# EasyEDA schematic SCH_Smart led driver_2022-09-08.json
TITLE: Sheet_1; REV: 1.0; Date: 2021-10-26; Sheet: 1/1; Drawn By: Max Solo; Company: Your Company
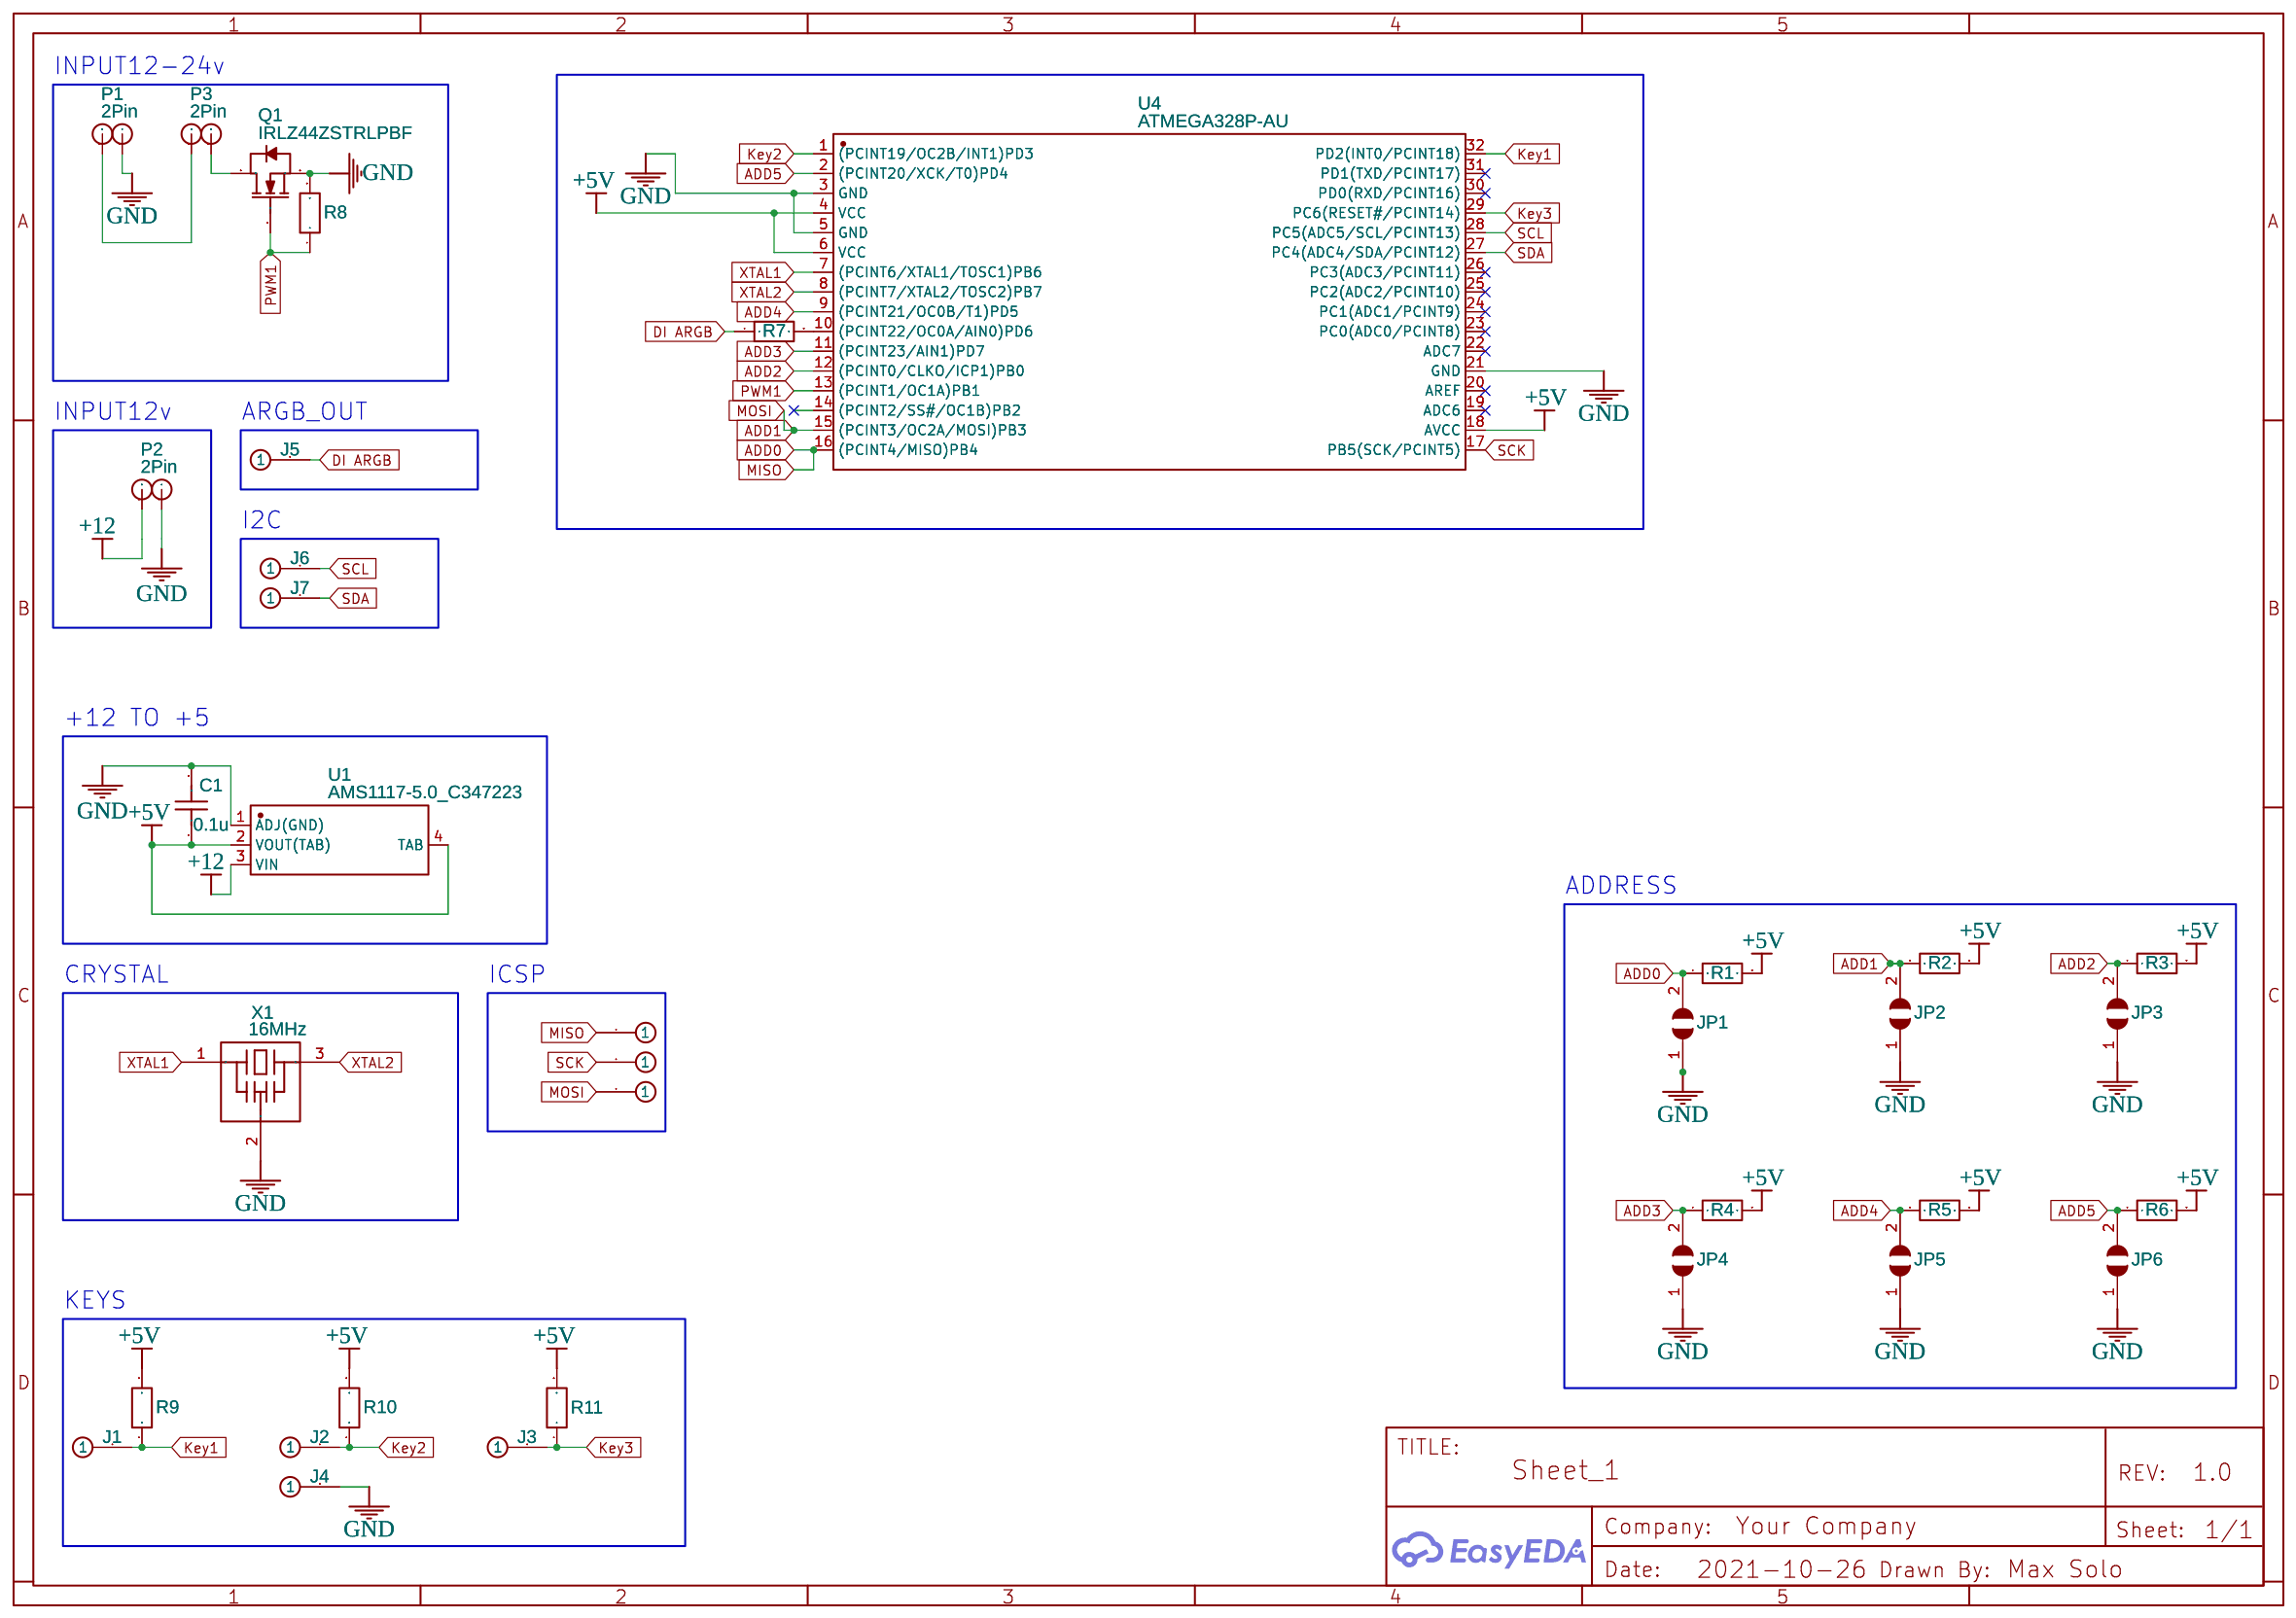
[diagram p0: schematic sheet]

## Parts
C1  0.1u  [C0603]
J1  1PIN_SMD  [1PIN_SMD]
J2  1PIN_SMD  [1PIN_SMD]
J3  1PIN_SMD  [1PIN_SMD]
J4  1PIN_SMD  [1PIN_SMD]
J5  1PIN_SMD  [1PIN_SMD]
J6  1PIN_SMD  [1PIN_SMD]
J7  1PIN_SMD  [1PIN_SMD]
J8  1PIN_SMD  [1PIN_SMD]
J9  1PIN_SMD  [1PIN_SMD]
J12  1PIN_SMD  [1PIN_SMD]
JP1  MINI-ULTRA-LORAWAN-rescue_JUMPER-1-WAY-RocketScreamKicadLibrary  [JUMPER-1-WAY-SMD]
JP2  MINI-ULTRA-LORAWAN-rescue_JUMPER-1-WAY-RocketScreamKicadLibrary  [JUMPER-1-WAY-SMD]
JP3  MINI-ULTRA-LORAWAN-rescue_JUMPER-1-WAY-RocketScreamKicadLibrary  [JUMPER-1-WAY-SMD]
JP4  MINI-ULTRA-LORAWAN-rescue_JUMPER-1-WAY-RocketScreamKicadLibrary  [JUMPER-1-WAY-SMD]
JP5  MINI-ULTRA-LORAWAN-rescue_JUMPER-1-WAY-RocketScreamKicadLibrary  [JUMPER-1-WAY-SMD]
JP6  MINI-ULTRA-LORAWAN-rescue_JUMPER-1-WAY-RocketScreamKicadLibrary  [JUMPER-1-WAY-SMD]
P1  2Pin  [2PIN]
P2  2Pin  [2PIN]
P3  2Pin  [2PIN]
Q1  IRLZ44ZSTRLPBF  [D2PAK_L10.0-W9.0-P2.54-LS15.0-BR]
R1  10k  [R0603]
R2  10k  [R0603]
R3  10k  [R0603]
R4  10k  [R0603]
R5  10k  [R0603]
R6  10k  [R0603]
R7  300  [R0603]
R8  10k  [R0603]
R9  1k  [R0603]
R10  1k  [R0603]
R11  1k  [R0603]
U1  AMS1117-5.0_C347223  [SOT-223_L6.7-W3.5-P2.30-BR]
U4  ATMEGA328P-AU  [TQFP-32_L7.0-W7.0-P0.80-LS9.0-BL]
X1  16MHz  [OSC-SMD_3P-L3.2-W1.3-P1.2-L]

## Library data of the parts
C1 = C_0603_US: Contributor: LCEDA_Lib
J1-J9 J12 = 1PIN_SMD: Contributor: JoshuaFireseed
JP1-JP6 = MINI-ULTRA-LORAWAN-rescue_JUMPER-1-WAY-RocketScreamKicadLibrary: Contributor: MOS-FET
P1-P3 = 2Pin: Contributor: danijel1023
Q1 = IRLZ44ZSTRLPBF: Supplier: LCSC; Supplier Part: C538201; Manufacturer: Infineon Technologies; Contributor: LCSC; JLCPCB Part Class: Extended Part
R1-R11 = R_0603_EU: Contributor: LCEDA_Lib
U1 = AMS1117-5.0_C347223: Supplier: LCSC; Supplier Part: C347223; Manufacturer: Youtai Semiconductor Co., Ltd.; Manufacturer Part: AMS1117-5.0; Contributor: LCSC; JLCPCB Part Class: Extended Part
U4 = ATMEGA328P-AU: Supplier: LCSC; Manufacturer: MICROCHIP; Supplier Part: C14877; JLCPCB Part Class: Basic Part
X1 = CSTCE16M0V13C99-R0: Supplier: LCSC; Manufacturer: MuRata; Supplier Part: C118038; JLCPCB Part Class: Extended Part

## Nets
+5V: C1.1 R1.2 R2.2 R3.2 R4.2 R5.2 R6.2 R9.2 R10.2 R11.2 U1.2(VOUT(TAB)) U1.4(TAB) U4.4(VCC) U4.6(VCC) U4.18(AVCC)
GND: C1.2 J4.1 JP1.1 JP2.1 JP3.1 JP4.1 JP5.1 JP6.1 P1.1 P2.1 Q1.3(S) R8.2 U1.1(ADJ(GND)) U4.3(GND) U4.5(GND) U4.21(GND) X1.2(VSS)
+12: P2.2 U1.3(VIN)
ADD0: J8.1 JP1.2 R1.1 U4.16((PCINT4/MISO)PB4)
ADD1: J12.1 JP2.2 R2.1 U4.15((PCINT3/OC2A/MOSI)PB3)
ADD2: JP3.2 R3.1 U4.12((PCINT0/CLKO/ICP1)PB0)
ADD3: JP4.2 R4.1 U4.11((PCINT23/AIN1)PD7)
ADD4: JP5.2 R5.1 U4.9((PCINT21/OC0B/T1)PD5)
ADD5: JP6.2 R6.1 U4.2((PCINT20/XCK/T0)PD4)
DI ARGB: J5.1 R7.1
Key1: J1.1 R9.1 U4.32(PD2(INT0/PCINT18))
Key2: J2.1 R10.1 U4.1((PCINT19/OC2B/INT1)PD3)
Key3: J3.1 R11.1 U4.29(PC6(RESET#/PCINT14))
PWM1: Q1.1(G) R8.1 U4.13((PCINT1/OC1A)PB1)
SCK: J9.1 U4.17(PB5(SCK/PCINT5))
SCL: J6.1 U4.28(PC5(ADC5/SCL/PCINT13))
SDA: J7.1 U4.27(PC4(ADC4/SDA/PCINT12))
XTAL1: U4.7((PCINT6/XTAL1/TOSC1)PB6) X1.1
XTAL2: U4.8((PCINT7/XTAL2/TOSC2)PB7) X1.3
Net-(P1-2): P1.2 P3.2
Net-(P3-1): P3.1 Q1.2(D)
Net-(R7-2): R7.2 U4.10((PCINT22/OC0A/AIN0)PD6)

Not connected (* = marked no-connect by the designer): U4 14((PCINT2/SS#/OC1B)PB2) 19(ADC6)* 20(AREF)* 22(ADC7)* 23(PC0(ADC0/PCINT8))* 24(PC1(ADC1/PCINT9))* 25(PC2(ADC2/PCINT10))* 26(PC3(ADC3/PCINT11))* 30(PD0(RXD/PCINT16))* 31(PD1(TXD/PCINT17))*

## Notes on the sheet
- INPUT12-24v
- INPUT12v
- ARGB_OUT
- I2C
- +12 TO +5
- ADDRESS
- CRYSTAL
- ICSP
- KEYS
